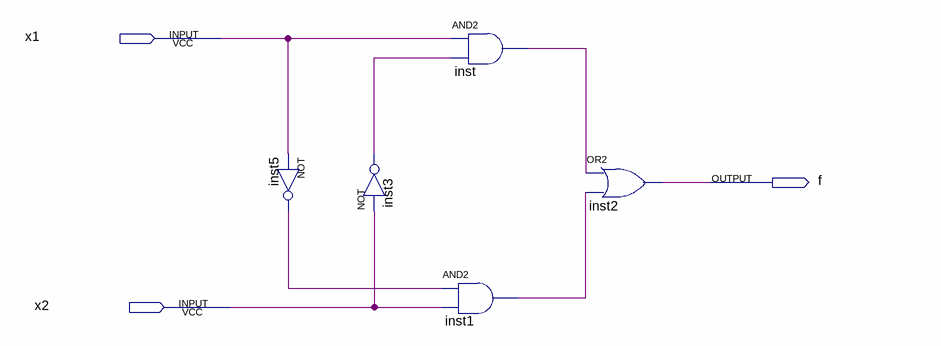
[diagram p0: schematic sheet]
// Quartus schematic introtutorial.bdf as structural Verilog: 5 symbols, 3 pins
module introtutorial (
  input  x1,
  input  x2,
  output f
);

  wire inst1_out, inst3_out, inst5_out, inst_out;

  not inst5 (inst5_out, x1);
  not inst3 (inst3_out, x2);
  and inst (inst_out, x1, inst3_out);
  and inst1 (inst1_out, inst5_out, x2);
  or inst2 (f, inst_out, inst1_out);
endmodule
